# EAGLE schematic Steering (EAGLE 9.6.2)
AUTHORS: Austin Keener, Peter Wilson, Johannes Kunz, Mukund Pandiri; REVISION: 1.1; SCH_DESC: Ethernet Breakout Board for Lidar Lite 3 Modules; TEAM: RoboRacing; TITLE: Lidar_Breakout
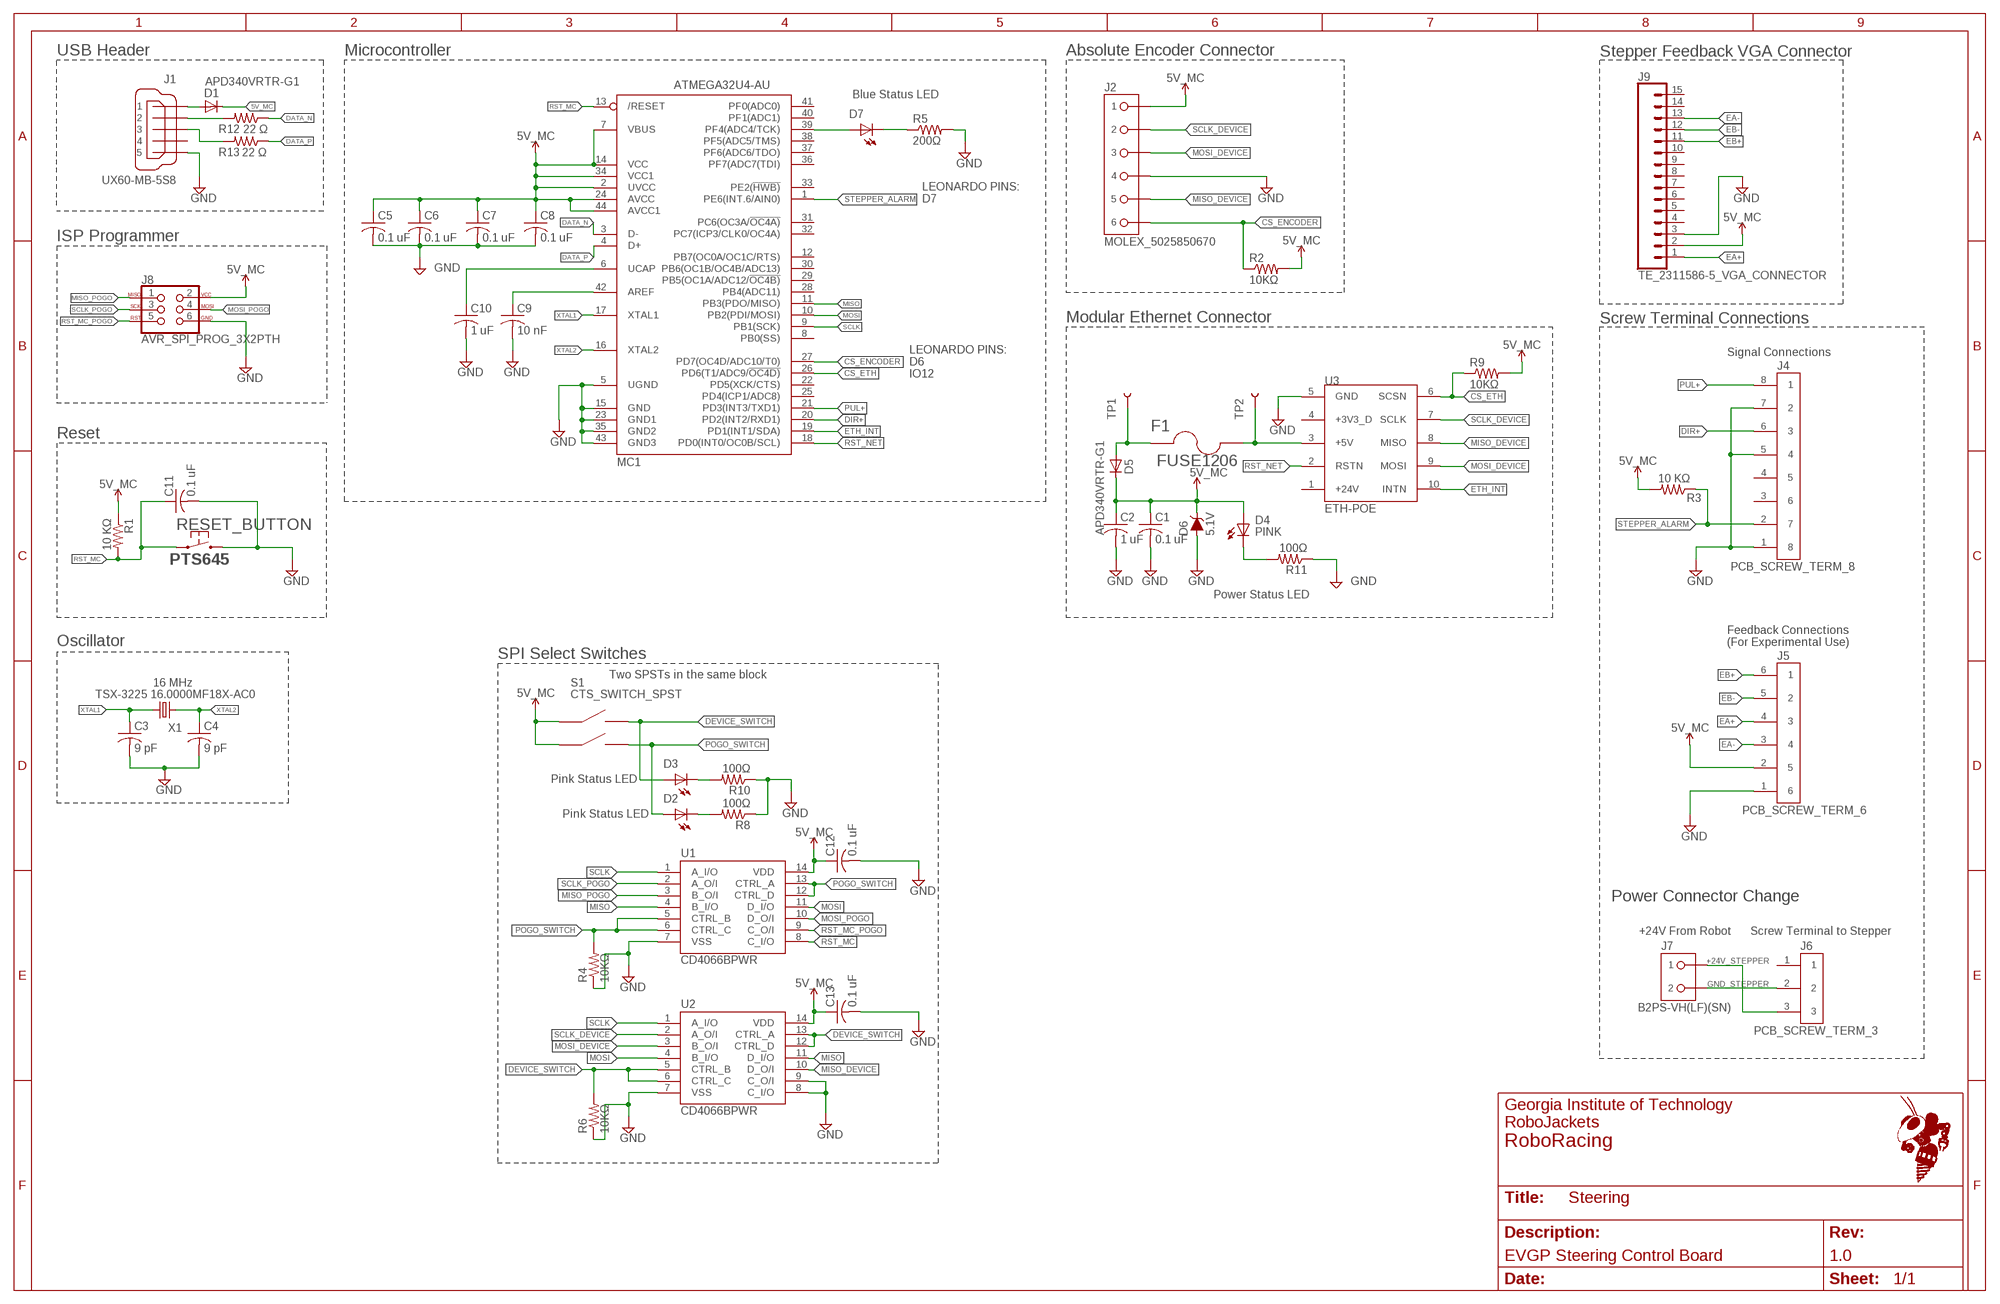
[diagram p0: schematic, sheet 1]
FRAME1 (FRAME_B_L): REVISION: 1.0; SCH_DESC: EVGP Steering Control Board

## Parts
C1  0.1 uF  C-USC0603  [C0603]
C2  1 uF  C-USC0603  [C0603]
C3  9 pF  C-USC0603  [C0603]
C4  9 pF  C-USC0603  [C0603]
C5  0.1 uF  C-USC0603  [C0603]
C6  0.1 uF  C-USC0603  [C0603]
C7  0.1 uF  C-USC0603  [C0603]
C8  0.1 uF  C-USC0603  [C0603]
C9  10 nF  C-USC0603  [C0603]
C10  1 uF  C-USC0603  [C0603]
C11  0.1 uF  C-USC0603  [C0603]
C12  0.1 uF  C-USC0603  [C0603]
C13  0.1 uF  C-USC0603  [C0603]
D1  APD340VRTR-G1  DIODE-DO-214AC  [DO-214AC]
D2  LED_AA3528VRVCS/A  [KINGBRIGHT_LED]
D3  LED_AA3528VRVCS/A  [KINGBRIGHT_LED]
D4  PINK  LED_AA3528VRVCS/A  [KINGBRIGHT_LED]
D5  APD340VRTR-G1  DIODE-DO-214AC  [DO-214AC]
D6  5.1V  DIODE-ZENER-MM3Z3V3T1G  [SOD-323]
D7  BLUE  LED-SMD-BLUE  [CHIP-LED0603]
F1  FUSE1206  [F1206]
J1  UX60-MB-5S8  [UX60-MB-5S8]
J2  MOLEX_5025850670  [MOLEX_5025850670]
J4  PCB_SCREW_TERM_8  [SCREW_TERMINAL_PCB_CONN_8_POLE]
J5  PCB_SCREW_TERM_6  [SCREW_TERMINAL_PCB_CONN_6_POLE]
J6  PCB_SCREW_TERM_3  [SCREW_TERMINAL_PCB_CONN_3_POLE]
J7  B2PS-VH(LF)(SN)  [B2PS-CENTERED]
J8  AVR_SPI_PROG_3X2PTH  [2X3]
J9  TE_2311586-5_VGA_CONNECTOR  [TE_VGA_2311586-5]
MC1  ATMEGA32U4-AU  [TQFP44]
R1  10 KΩ  R-US_R0603  [R0603]
R2  10KΩ  R0603W  [R0603W]
R3  10 KΩ  R-US_R0603  [R0603]
R4  10KΩ  R0603W  [R0603W]
R5  200Ω  R0603W  [R0603W]
R6  10KΩ  R0603W  [R0603W]
R8  100Ω  R0603W  [R0603W]
R9  10KΩ  R0603W  [R0603W]
R10  100Ω  R0603W  [R0603W]
R11  100Ω  R0603W  [R0603W]
R12  22 Ω  R-US_R0603  [R0603]
R13  22 Ω  R-US_R0603  [R0603]
RESET_BUTTON  PTS645  [PTS645]
S1  CTS_SWITCH_SPST  [CTS_DIP_SWITCH]
TP1  TEST-POINTTP_15TH_THRU  [TP_15TH]
TP2  TEST-POINTTP_15TH_THRU  [TP_15TH]
U1  CD4066BPWR  [TSSOP14]
U2  CD4066BPWR  [TSSOP14]
U3  ETH-POE  [HDRVR10W64P4000X254_2X5_1016X508X254B]
X1  TSX-3225 16.0000MF18X-AC0  XTAL-3.2X2.5  [XTAL-3.2X2.5]

## Nets
5V_MC: C1.1 C2.1 C5.1 C6.1 C7.1 C8.1 C12.1 C13.1 D1.C D4.P$2(A) D5.C D6.C J2.1 J5.2 J8.2 J9.2 MC1.2(UVCC) MC1.7(VBUS) MC1.14(VCC) MC1.24(AVCC) MC1.34(VCC1) MC1.44(AVCC1) R1.1 R2.2(PIN2) R3.2 R9.2(PIN2) S1.A2(COMMON) S1.B2(COMMON1) U1.14(VDD) U2.14(VDD)
+24V_STEPPER: J6.3 J7.1
AREF: C9.1 MC1.42(AREF)
CS_ENCODER: J2.6 MC1.27(PD7(OC4D/ADC10/T0)) R2.1(PIN1)
CS_ETH: MC1.26(PD6(T1/ADC9/!OC4D)) R9.1(PIN1) U3.6(SCSN)
DATA_N [diff]: MC1.3(D-) R12.1
DATA_P [diff]: MC1.4(D+) R13.1
DEVICE_SWITCH: D3.P$2(A) R6.2(PIN2) S1.A1(A) U2.5(CTRL_B) U2.6(CTRL_C) U2.12(CTRL_D) U2.13(CTRL_A)
DIR+: J4.6 MC1.20(PD2(INT2/RXD1))
EA+: J5.4 J9.1
EA-: J5.3 J9.13
EB+: J5.6 J9.11
EB-: J5.5 J9.12
ETH_INT: MC1.19(PD1(INT1/SDA)) U3.10(INTN)
GND: C1.2 C2.2 C3.2 C4.2 C5.2 C6.2 C7.2 C8.2 C9.2 C10.2 C11.2 C12.2 C13.2 D6.A J1.5 J2.4 J4.1 J4.5 J4.7 J5.1 J8.6 J9.3 MC1.5(UGND) MC1.15(GND) MC1.23(GND1) MC1.35(GND2) MC1.43(GND3) R4.1(PIN1) R5.2(PIN2) R6.1(PIN1) R8.1(PIN1) R10.1(PIN1) R11.1(PIN1) RESET_BUTTON.P$3 RESET_BUTTON.P$4 U1.7(VSS) U2.7(VSS) U2.8(C_I/O) U2.9(C_O/I) U3.5(GND)
GND_STEPPER: J6.2 J7.2
MISO: MC1.11(PB3(PDO/MISO)) U1.4(B_I/O) U2.11(D_I/O)
MISO_DEVICE: J2.5 U2.10(D_O/I) U3.8(MISO)
MISO_POGO: J8.1 U1.3(B_O/I)
MOSI: MC1.10(PB2(PDI/MOSI)) U1.11(D_I/O) U2.4(B_I/O)
MOSI_DEVICE: J2.3 U2.3(B_O/I) U3.9(MOSI)
MOSI_POGO: J8.4 U1.10(D_O/I)
N$1: D1.A J1.1
N$2: D7.A MC1.39(PF4(ADC4/TCK))
N$3: D7.C(K) R5.1(PIN1)
N$4: D3.P$1(B) R10.2(PIN2)
N$6: D2.P$1(B) R8.2(PIN2)
N$8: J1.2 R12.2
N$9: F1.2 TP2.P$1 U3.3(+5V)
N$10: D4.P$1(B) R11.2(PIN2)
N$12: D5.A F1.1 TP1.P$1
N$23: J1.3 R13.2
POGO_SWITCH: D2.P$2(A) R4.2(PIN2) S1.B1(A1) U1.5(CTRL_B) U1.6(CTRL_C) U1.12(CTRL_D) U1.13(CTRL_A)
PUL+: J4.8 MC1.21(PD3(INT3/TXD1))
RST_MC: C11.1 MC1.13(/RESET) R1.2 RESET_BUTTON.P$1 RESET_BUTTON.P$2 U1.8(C_I/O)
RST_MC_POGO: J8.5 U1.9(C_O/I)
RST_NET: MC1.18(PD0(INT0/OC0B/SCL)) U3.2(RSTN)
SCLK: MC1.9(PB1(SCK)) U1.1(A_I/O) U2.1(A_I/O)
SCLK_DEVICE: J2.2 U2.2(A_O/I) U3.7(SCLK)
SCLK_POGO: J8.3 U1.2(A_O/I)
STEPPER_ALARM: J4.2 MC1.1(PE6(INT.6/AIN0)) R3.1
UCAP: C10.1 MC1.6(UCAP)
XTAL1: C3.1 MC1.17(XTAL1) X1.1
XTAL2: C4.1 MC1.16(XTAL2) X1.3
Unconnected: J1.4 J4.3 J4.4 J6.1 J9.4 J9.5 J9.6 J9.7 J9.8 J9.9 J9.10 J9.14 J9.15 MC1.8(PB0(SS)) MC1.12(PB7(OC0A/OC1C/RTS)) MC1.22(PD5(XCK/CTS)) MC1.25(PD4(ICP1/ADC8)) MC1.28(PB4(ADC11)) MC1.29(PB5(OC1A/ADC12/!OC4B)) MC1.30(PB6(OC1B/OC4B/ADC13)) MC1.31(PC6(OC3A/!OC4A)) MC1.32(PC7(ICP3/CLK0/OC4A)) MC1.33(PE2(!HWB)) MC1.36(PF7(ADC7(TDI)) MC1.37(PF6(ADC6/TDO)) MC1.38(PF5(ADC5/TMS)) MC1.40(PF1(ADC1)) MC1.41(PF0(ADC0)) U3.1(+24V) U3.4(+3V3_D)

## Notes on the sheet
- USB Header | Microcontroller | Absolute Encoder Connector | Stepper Feedback VGA Connector
- Blue Status LED
- LEONARDO PINS:
  D7
- ISP Programmer
- Modular Ethernet Connector | Screw Terminal Connections
- Signal Connections
- LEONARDO PINS:
  D6
  IO12
- Reset
- Power Status LED
- Oscillator
- Feedback Connections 
  (For Experimental Use)
- SPI Select Switches
- Two SPSTs in the same block
- 16 MHz
- Pink Status LED
- Pink Status LED
- Power Connector Change
- +24V From Robot | Screw Terminal to Stepper

## Library data of the parts
C1-C13 = resistor:C-US: CAPACITOR, American symbol
D1 D5 = RoboJackets-Diodes:DIODE-: DIODE
D2-D4 = Steering:LED_AA3528VRVCS/A: Pink Kingsbright LED; DKPN: 754-1534-1-ND
D6 = SparkFun-DiscreteSemi:DIODE-ZENER: Zener Diode A Zener diode allows current to flow from its anode to its cathode like a normal semiconductor diode, but it also permits current to flow in the reverse direction when its "Zener voltage" is reached. - WIkipedia; PROD_ID: DIO-11284; VALUE: 3.3V
D7 = RoboJackets-LEDs:LED-SMD; DIGIKEY: 160-1647-1-ND; MPN: LTST-C191TBKT
F1 = RoboJackets-Passive:FUSE
J1 = RoboJackets-Connectors:UX60*-MB-5S?: Mini USB Connector Brand: Hirose Electric Co Ltd <http://www.hirose.com/us/> Series: UX <http://www.digikey.com/product-search/en?FV=fff40016,fff802e4,ffec3225> Distributor: Digi-Key <http://www.digikey.com/product-detail/en/UX60A-MB-5ST/H2961CT-ND/597540>; PINS: 5
J2 = Steering:MOLEX_5025850670
J4 = Steering:PCB_SCREW_TERM_8; DKPT: 732-2774-ND
J5 = Steering:PCB_SCREW_TERM_6; DKPT: 732-2773-ND
J6 = Steering:PCB_SCREW_TERM_3; DKPT: 732-2770-ND
J7 = RoboJackets-Connectors:B2P?-VH(LF)(SN): Power Connector Brand: JST Sales America Inc. <https://www.jst.com/> Series: VH <http://www.digikey.com/product-search/en?FV=fff40016,fff802f3,ffec0e9d> Distributor: Digi-Key <http://www.digikey.com/product-detail/en/B2PS-VH%28LF%29%28SN%29/455-1648-ND/926555>; DIGIKEY: 455-1648-ND; MPN: B2PS-VH(LF)(SN)
J8 = SparkFun-Connectors:AVR_SPI_PROG_3X2: AVR ISP 6 Pin This is the reduced ISP connector for AVR programming. Common on Arduino. This footprint will take up less PCB space and can be used with a 10-pin to 6-pin adapter such as SKU: BOB-08508 **Special note about "TEST_POINT" package. The stop mask is on the top side, so if you want your programming test points to be on the bottom of your board, make sure to place this package on the bottom side of the board. This also ensure that the orientation to program from the bottom side will be correct. SparkFun Products: SparkFun ISP Pogo Adapter <https://www.sparkfun.com/products/11591> - NS Tiny AVR Programmer <https://www.sparkfun.com/products/11801> -PTH
J9 = Steering:TE_2311586-5_VGA_CONNECTOR: 15 Position D-Sub, High Density Receptacle, Female Sockets Connector; DKPN: A144832-ND
MC1 = adafruit:ATMEGA32U4: http://www.ladyada.net/library/eagle
R1 R3 R12 R13 = rcl:R-US_: RESISTOR, American symbol; SPICEPREFIX: R
R2 R4-R6 R8-R11 = RoboJackets-Resistors:R0603W
RESET_BUTTON = RoboJackets-Switches:PTS645
S1 = Steering:CTS_SWITCH_SPST: 2 position DIP switch; DKPT: CT3113CT-ND
TP1 TP2 = SparkFun-Connectors:TEST-POINT: SparkFun Test Points Bare copper test points for troubleshooting or In-Circuit-Testing. These are used by our Production team for verifying production board runs using pogo-pins on test beds. SparkFun Products: SparkFun LSM9DS1 Breakout <https://www.sparkfun.com/products/13284> SparkFun PSOC <https://www.sparkfun.com/products/13714> SparkFun Load Cell Amplifier <https://www.sparkfun.com/products/13879>
U1 U2 = Steering:CD4066BPWR: Bilateral switch IC for controlling data lines. Vss should normally be connected to GND.; DKPN: 296-14123-1-ND
U3 = ethernet_poe:ETH-POE: POE
X1 = RoboJackets-FreqGen:XTAL

## Net classes
0 default: width 0.203 mm
2 diff: width 0.406 mm